# Altium schematic sheet Pi_BISS_422_485.SchDoc: =DocumentName
size B; DrawnBy: Cary Smith; Organization: Las Cumbres Observatoy; Address1: 6740 Cortona Dr.; Address2: Suite 102; Address3: Goleta, CA 93117; DocumentNumber: 1; Revision: 1; SheetNumber: 1; SheetTotal: 1000's
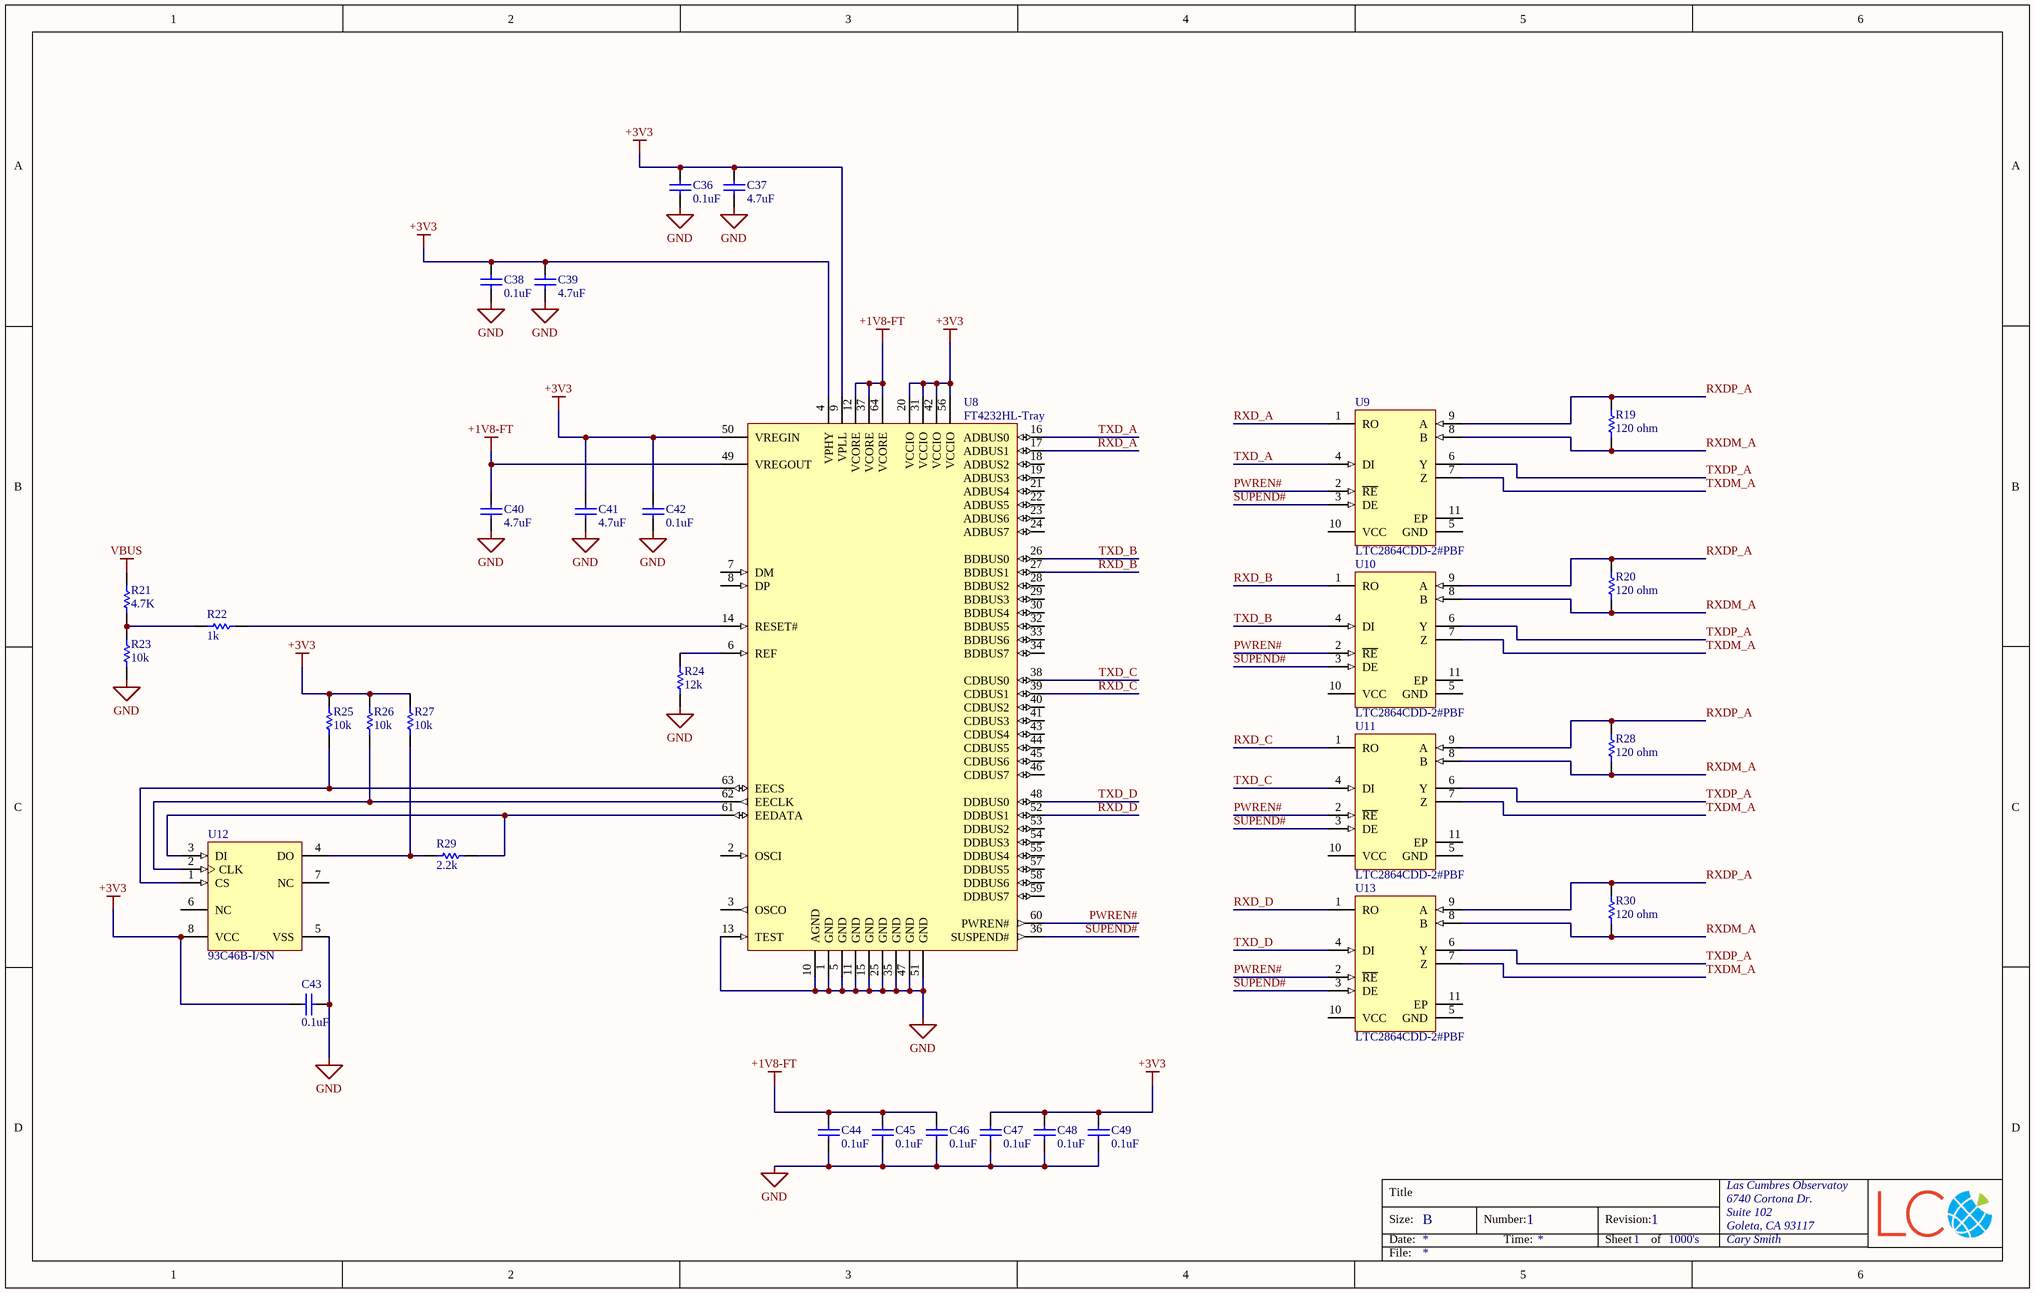
[diagram p0: Pi_BISS_422_485.SchDoc]

## Parts
C36  0.1uF  [CAPC1005X55X25ML05T10]
C37  4.7uF  [CAPC1608X90X35ML10T15]
C38  0.1uF  [CAPC1005X55X25ML05T10]
C39  4.7uF  [CAPC1608X90X35ML10T15]
C40  4.7uF  [CAPC1608X90X35ML10T15]
C41  4.7uF  [CAPC1608X90X35ML10T15]
C42  0.1uF  [CAPC1005X55X25ML05T10]
C43  0.1uF  [CAPC1005X55X25ML05T10]
C44  0.1uF  [CAPC1005X55X25ML05T10]
C45  0.1uF  [CAPC1005X55X25ML05T10]
C46  0.1uF  [CAPC1005X55X25ML05T10]
C47  0.1uF  [CAPC1005X55X25ML05T10]
C48  0.1uF  [CAPC1005X55X25ML05T10]
C49  0.1uF  [CAPC1005X55X25ML05T10]
R19  120 ohm  [RESC3216X60X45ML10T20]
R20  120 ohm  [RESC3216X60X45ML10T20]
R21  4.7K  [RESC1005X40X25ML05T05]
R22  1k  [RESC1005X40X25LL05T10]
R23  10k  [RESC1005X40X25NL05T05]
R24  12k  [RESC1005X40X25NL05T05]
R25  10k  [RESC1005X40X25NL05T05]
R26  10k  [RESC1005X40X25NL05T05]
R27  10k  [RESC1005X40X25NL05T05]
R28  120 ohm  [RESC3216X60X45ML10T20]
R29  2.2k  [RESC1005X40X25LL10T10]
R30  120 ohm  [RESC3216X60X45ML10T20]
U8  FT4232HL-Tray  [LQFP-64_M]
U9  LTC2864CDD-2#PBF  [LT-DD-10_V]
U10  LTC2864CDD-2#PBF  [LT-DD-10_V]
U11  LTC2864CDD-2#PBF  [LT-DD-10_V]
U12  93C46B-I/SN  [SOIC-SN8_M]
U13  LTC2864CDD-2#PBF  [LT-DD-10_V]

## Nets
+1V8-FT: C40.2 C44.1 C45.1 C46.1 U8.12(VCORE) U8.37(VCORE) U8.49(VREGOUT) U8.64(VCORE)
+3V3: C36.1 C37.2 C38.1 C39.2 C41.2 C42.1 C43.2 C47.1 C48.1 C49.1 R25.2 R26.2 R27.2 U8.4(VPHY) U8.9(VPLL) U8.20(VCCIO) U8.31(VCCIO) U8.42(VCCIO) U8.50(VREGIN) U8.56(VCCIO) U12.8(VCC)
GND: C36.2 C37.1 C38.2 C39.1 C40.1 C41.1 C42.2 C43.1 C44.2 C45.2 C46.2 C47.2 C48.2 C49.2 R23.1 R24.1 U8.1(GND) U8.5(GND) U8.10(AGND) U8.11(GND) U8.13(TEST) U8.15(GND) U8.25(GND) U8.35(GND) U8.47(GND) U8.51(GND) U12.5(VSS)
VBUS: R21.2
PWREN#: U8.60(PWREN#) U9.2(~{RE}) U10.2(~{RE}) U11.2(~{RE}) U13.2(~{RE})
RXD_A: U8.17(ADBUS1) U9.1(RO)
RXD_B: U8.27(BDBUS1) U10.1(RO)
RXD_C: U8.39(CDBUS1) U11.1(RO)
RXD_D: U8.52(DDBUS1) U13.1(RO)
RXDM_A: R19.1 R20.1 R28.1 R30.1 U9.8(B) U10.8(B) U11.8(B) U13.8(B)
RXDP_A: R19.2 R20.2 R28.2 R30.2 U9.9(A) U10.9(A) U11.9(A) U13.9(A)
SUPEND#: U8.36(SUSPEND#) U9.3(DE) U10.3(DE) U11.3(DE) U13.3(DE)
TXD_A: U8.16(ADBUS0) U9.4(DI)
TXD_B: U8.26(BDBUS0) U10.4(DI)
TXD_C: U8.38(CDBUS0) U11.4(DI)
TXD_D: U8.48(DDBUS0) U13.4(DI)
TXDM_A: U9.7(Z) U10.7(Z) U11.7(Z) U13.7(Z)
TXDP_A: U9.6(Y) U10.6(Y) U11.6(Y) U13.6(Y)
NetR21_1: R21.1 R22.1 R23.2
NetR22_2: R22.2 U8.14(RESET#)
NetR24_2: R24.2 U8.6(REF)
NetR25_1: R25.1 U8.63(EECS) U12.1(CS)
NetR26_1: R26.1 U8.62(EECLK) U12.2(CLK)
NetR27_1: R27.1 R29.1 U12.4(DO)
NetR29_2: R29.2 U8.61(EEDATA) U12.3(DI)

Not connected (* = marked no-connect by the designer): U8 2(OSCI) 3(OSCO) 7(DM) 8(DP) 18(ADBUS2) 19(ADBUS3) 21(ADBUS4) 22(ADBUS5) 23(ADBUS6) 24(ADBUS7) 28(BDBUS2) 29(BDBUS3) 30(BDBUS4) 32(BDBUS5) 33(BDBUS6) 34(BDBUS7) 40(CDBUS2) 41(CDBUS3) 43(CDBUS4) 44(CDBUS5) 45(CDBUS6) 46(CDBUS7) 53(DDBUS2) 54(DDBUS3) 55(DDBUS4) 57(DDBUS5) 58(DDBUS6) 59(DDBUS7); U9 5(GND) 10(VCC) 11(EP); U10 5(GND) 10(VCC) 11(EP); U11 5(GND) 10(VCC) 11(EP); U12 6(NC) 7(NC); U13 5(GND) 10(VCC) 11(EP)

## Notes on the sheet
- Title
- Size:
- Date:
- B
- Number:
- Time:
- Revision:
- Sheet
- of
- File:

## Library data of the parts
C36 C38 C42-C49 = CMP-2008-02013-1: VJ0402G104KXQCW1BC; Manufacturer: Vitramon; Part Number: VJ0402G104KXQCW1BC
C37 C39-C41 = CMP-2006-02799-2: Chip Capacitor, 4.7 uF, +/- 10%, 6.3 V, -55 to 85 degC, 0603 (1608 Metric), RoHS, Tape and Reel GRM188R60J475KE19D; Voltage Rating (DC): 3 V; Voltage Rating: 6.3 V; Type (Capacitors): X5R; Case/Package: 0603; Case Code (Imperial): 0603; Packaging: Tape and Reel; Mount: Surface Mount; Height: 0.8 mm; REACH SVHC: No SVHC; ComponentLink1URL: http://www.murata.com/; ComponentLink2URL: http://psearch.en.murata.com/capacitor/product/GRM188R60J475KE19%23.pdf; Min Operating Temperature: -55 degC; Max Operating Temperature: 85 degC; Length: 1.6 mm; Case Code (Metric): 1608; Radiation Hardening: No; PackageDescription: 2-Pin Surface Mount Device, Body 1.6 x 0.8 mm; RoHSCompliant: true; PartNumber: GRM188R60J475KE19D; Tolerance: 10%; Width: 0.8 mm; ComponentLink1Description: Manufacturer URL; Mounting Technology: Surface Mount; ComponentLink2Description: Datasheet; Capacitance: 4.7 uF; Package Quantity: 4000; DatasheetVersion: 08/2016
R19 R20 R28 R30 = CMP-2003-04839-1: CRCW1206120RJNEA; Manufacturer: Vishay Dale; Part Number: CRCW1206120RJNEA
R21 = CMP-2002-00051-2: Chip Resistor, 4.7 KOhm, +/- 1%, 63 mW, -55 to 155 degC, 0402 (1005 Metric), RoHS, Tape and Reel CRCW04024K70FKED; Power Rating: 63 mW; Voltage Rating: 50 V; Length: 1 mm; Mount: Surface Mount; Case Code (Metric): 1005; ComponentLink1Description: Datasheet; Package Quantity: 10000; Case Code (Imperial): 0402; Max Operating Temperature: 155 degC; PartNumber: CRCW04024K70FKED; Case/Package: 0402; REACH SVHC: Unknown; PackageDescription: 2-Pin Surface Mount Device, Body 1 x 0.5 mm; Width: 0.5 mm; Min Operating Temperature: -55 degC; Resistance: 4.7 KOhm; Height: 0.35 mm; Packaging: Tape and Reel; Mounting Technology: Surface Mount; Tolerance: 1%; RoHSCompliant: True; ComponentLink1URL: http://www.vishay.com/docs/20035/dcrcwe3.pdf
R22 = CMP-2002-03045-1: CRCW04021K00FKEDHP; Manufacturer: Vishay Dale; Part Number: CRCW04021K00FKEDHP
R23 R25-R27 = CMP-2002-08135-1: CRCW040210K0FKED; Manufacturer: Vishay Dale; Part Number: CRCW040210K0FKED
R24 = CMP-2002-08177-1: CRCW040212K0FKED; Manufacturer: Vishay Dale; Part Number: CRCW040212K0FKED
R29 = CMP-2002-03743-1: RK73B1ETTP222J; Manufacturer: KOA Speer; Part Number: RK73B1ETTP222J
U8 = CMP-0078-00018-3: Quad High Speed USB To Multipurpose UART/MPSSE IC, 64-pin LQFP, Tray; Manufacturer: FTDI; PartNumber: FT4232HL-Tray; RevisionNote: DatasheetVersion updated to 2.2 Jan-2012; PackageReference: LQFP-64; ComponentLink1URL: http://www.ftdichip.com/; ComponentLink2URL: http://www.ftdichip.com/Support/Documents/DataSheets/ICs/DS_FT4232H.pdf; PackageVersion: Jan-12; ComponentLink2Description: Datasheet; DatasheetVersion: ver 2.2, Jan-2012; PackageDescription: 64-Pin Thin Quad Flat Pack, 10 x 10 x 1.4 mm Body, 0.5 mm Pitch; ComponentLink1Description: Manufacturer URL
U9-U11 U13 = CMP-1336-00005-1: RS485/RS422 Transceiver, Fault Protected +/- 60 V, 3 to 5.5 V, 0 to 70 degC, 10-Pin DFN (DD-10), RoHS, Tube; Manufacturer: Linear Technology; Fault Protected: +/- 60 V; Duplex: Full; Receiver Hysteresis: 25 mV; Drivers: 1; fMAX: 250 kbps Min.; Packing: Tube; PackageDescription: 10-Pin Plastic Dual Flat Package, Body 3 x 3 mm, Pitch 0.5 mm; DatasheetVersion: Rev. C; RoHS: TRUE; PackageVersion: Rev. C; ComponentLink2URL: http://cds.linear.com/docs/en/datasheet/2862345fc.pdf; VCC: 3 to 5.5 V; Temperature Range: 0 to 70 degC; PartNumber: LTC2864CDD-2#PBF; ComponentLink3Description: Package Specification; Mounting Technology: Surface Mount; ComponentLink2Description: Datasheet; ComponentLink3URL: http://cds.linear.com/docs/en/packaging/DFN_10_05-08-1699.pdf; ComponentLink1Description: Manufacturer URL; ComponentLink1URL: http://www.linear.com/
U12 = CMP-0162-00274-1: 1K, 64x16-bit, 5.0V Microwire Serial EEPROM, 8-Pin SOIC 150mil, Industrial Temperature; Code_IPC: SOIC127P600-8; PackageDescription: 8-Lead Plastic Small Outline (SN) - Narrow, 3.90mm Body [SOIC]; PackageVersion: revBB, Aug-2009; DatasheetVersion: revG, May-2008; PackageReference: SOIC-SN8; Code_JEDEC: MS-012